# EAGLE schematic rapidshark_mark_5 (EAGLE 6.5.0)
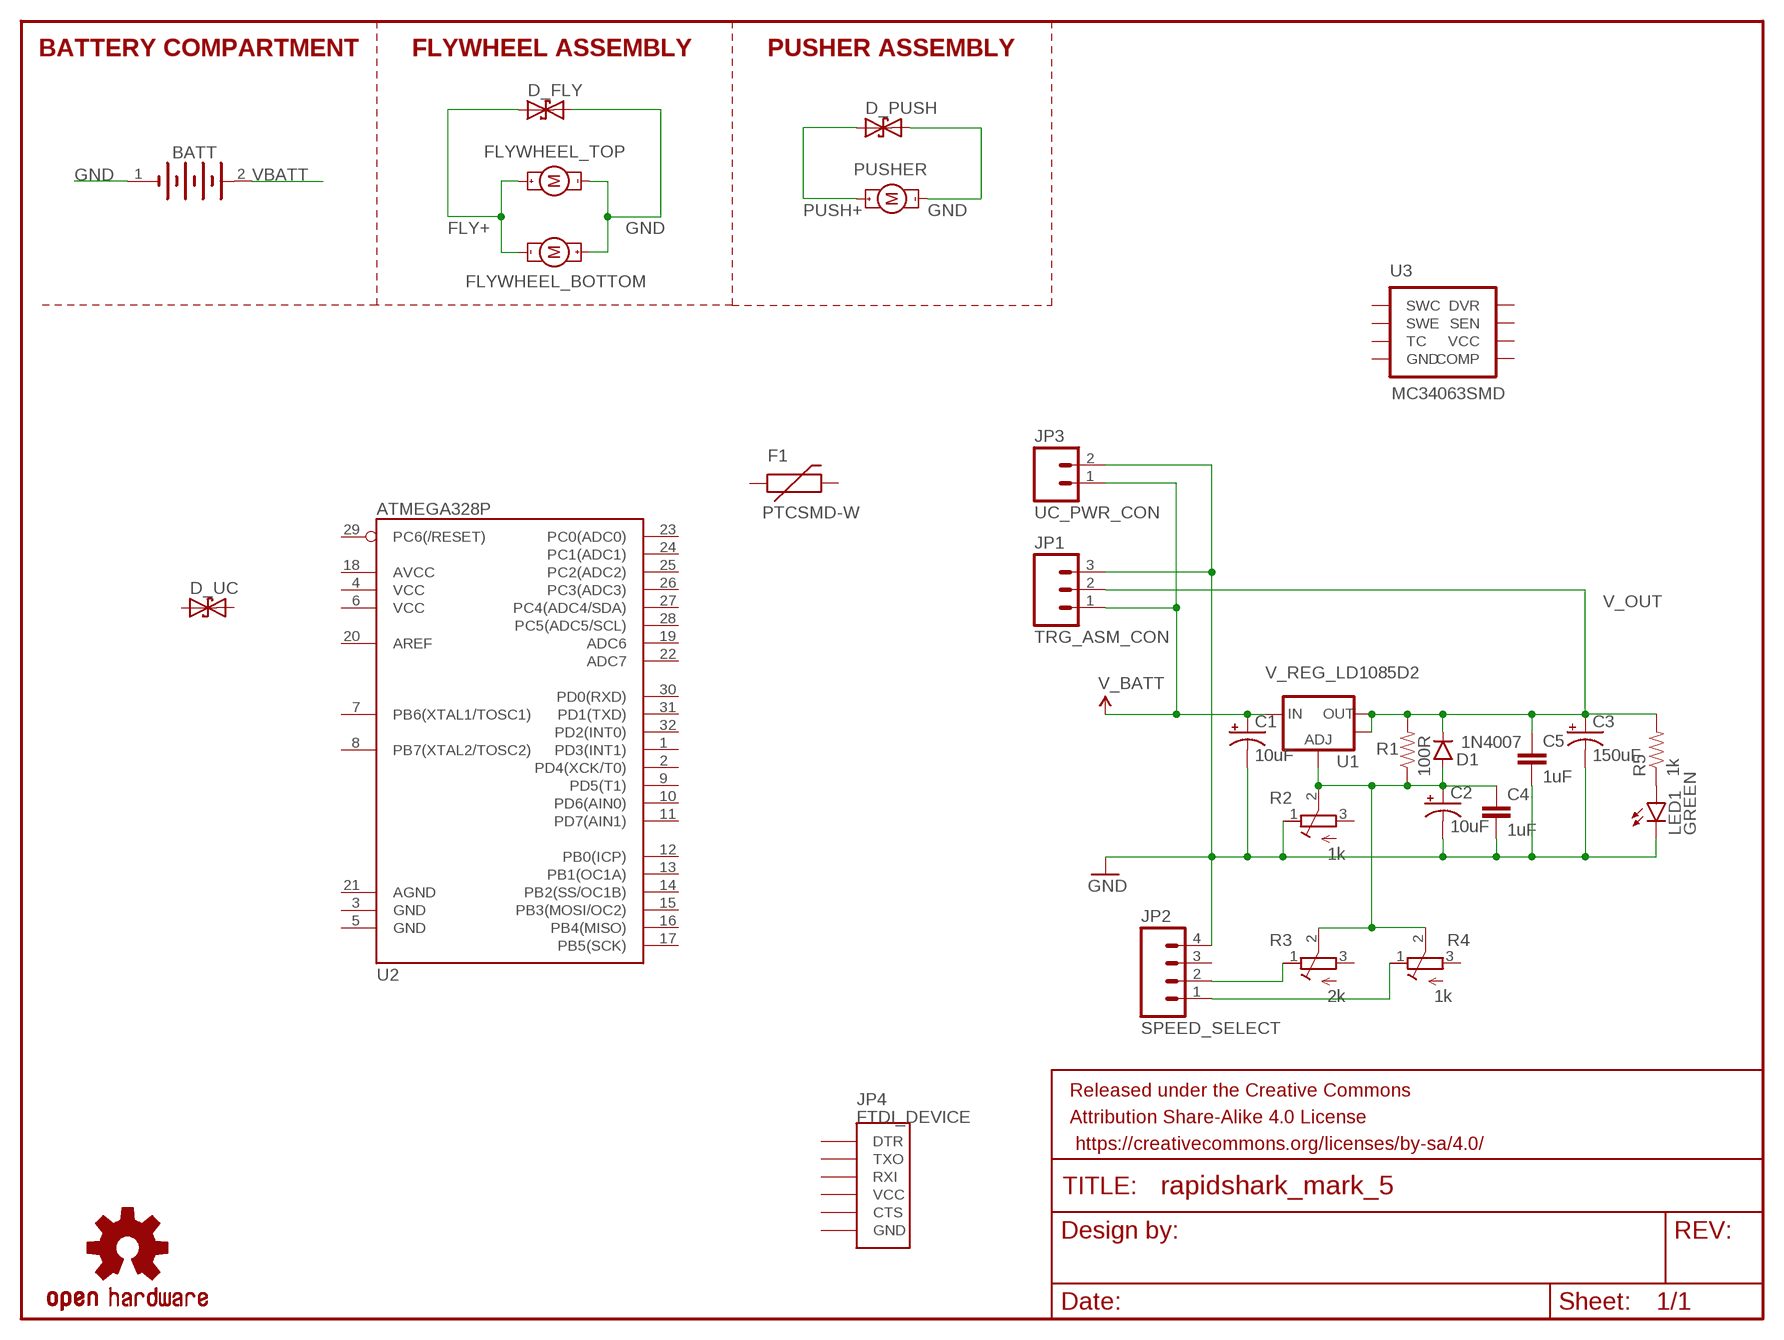
[diagram p0: schematic, sheet 1]

## Parts
BATT  LIPO4S_14.8V_EXT5MMSCREW  [1X02_5MM_SCREW]
C1  10uF  CPOL-USE2-5  [E2-5]
C2  10uF  CPOL-USE2-5  [E2-5]
C3  150uF  CPOL-USTT5D11L  [TT5D11L]
C4  1uF  CAPPTH  [CAP-PTH-SMALL]
C5  1uF  CAPPTH  [CAP-PTH-SMALL]
D1  1N4007  DIODEPTH  [DIODE-1N4001]
D_FLY  P6KEXXC  [CB417-15]
D_PUSH  P6KEXXC  [CB417-15]
D_UC  P6KEXXC  [CB417-15]
F1  PTCSMD-W  [PTC-1206-WIDE]
FLYWHEEL_BOTTOM  MOTOR  (no package)
FLYWHEEL_TOP  MOTOR  (no package)
FRAME1  FRAME-LETTER  [CREATIVE_COMMONS]
JP1  TRG_ASM_CON  M03-SCREW-5MM  [SCREWTERMINAL-5MM-3]
JP2  SPEED_SELECT  M04PTH  [1X04]
JP3  UC_PWR_CON  M02PTH  [1X02]
JP4  FTDI_DEVICE  [FTDI_DEVICE_SIDE]
LED1  GREEN  LED3MM  [LED3MM]
LOGO1  OSHW-LOGOS  [OSHW-LOGO-S]
PUSHER  MOTOR  (no package)
R1  100R  RESISTORAXIAL-0.3  [AXIAL-0.3]
R2  1k  R-TRIMMT93XA  [RTRIMT93XA]
R3  2k  R-TRIMMT93XA  [RTRIMT93XA]
R4  1k  R-TRIMMT93XA  [RTRIMT93XA]
R5  1k  RESISTORAXIAL-0.3  [AXIAL-0.3]
U1  V_REG_LD1085D2  [D2PACK/A]
U2  ATMEGA328P  ATMEGA328_SMT  [TQFP32-08]
U3  MC34063SMD  [SO08]

## Nets
ADJ: C2.+ C4.1 D1.A R1.P$1 R2.2(S) R3.2(S) R4.2(S) U1.1(ADJ)
FLY+: D_FLY.A FLYWHEEL_BOTTOM.- FLYWHEEL_TOP.+
GND: BATT.1(-) C1.- C2.- C3.- C4.2 C5.2 D_FLY.C D_PUSH.C FLYWHEEL_BOTTOM.+ FLYWHEEL_TOP.- JP1.3 JP2.4 JP3.2 LED1.K(C) PUSHER.- R2.1(A)
N$1: JP2.2 R3.1(A)
N$2: JP2.1 R4.1(A)
N$3: LED1.A R5.P$1
PUSH+: D_PUSH.A PUSHER.+
V_BATT: C1.+ JP1.1 JP3.1 U1.3(IN)
V_OUT: C3.+ C5.1 D1.C JP1.2 R1.P$2 R5.P$2 U1.2(OUT) U1.TAB(OUT)
VBATT: BATT.2(+)
Unconnected: D_UC.A D_UC.C F1.1 F1.2 JP2.3 JP4.P$1(DTR) JP4.P$2(TXO) JP4.P$3(RXI) JP4.P$4(VCC) JP4.P$5(CTS) JP4.P$6(GND) R2.3(E) R3.3(E) R4.3(E) U2.1(PD3(INT1)) U2.2(PD4(XCK/T0)) U2.3(GND) U2.4(VCC) U2.5(GND) U2.6(VCC) U2.7(PB6(XTAL1/TOSC1)) U2.8(PB7(XTAL2/TOSC2)) U2.9(PD5(T1)) U2.10(PD6(AIN0)) U2.11(PD7(AIN1)) U2.12(PB0(ICP)) U2.13(PB1(OC1A)) U2.14(PB2(SS/OC1B)) U2.15(PB3(MOSI/OC2)) U2.16(PB4(MISO)) U2.17(PB5(SCK)) U2.18(AVCC) U2.19(ADC6) U2.20(AREF) U2.21(AGND) U2.22(ADC7) U2.23(PC0(ADC0)) U2.24(PC1(ADC1)) U2.25(PC2(ADC2)) U2.26(PC3(ADC3)) U2.27(PC4(ADC4/SDA)) U2.28(PC5(ADC5/SCL)) U2.29(PC6(/RESET)) U2.30(PD0(RXD)) U2.31(PD1(TXD)) U2.32(PD2(INT0)) U3.1(SWC) U3.2(SWE) U3.3(TC) U3.4(GND) U3.5(COMP) U3.6(VCC) U3.7(SEN) U3.8(DVR)

## Notes on the sheet
- BATTERY COMPARTMENT | FLYWHEEL ASSEMBLY | PUSHER ASSEMBLY

## Library data of the parts
BATT = butts:LIPO4S_14.8V_EXT: NC ACCU Varta Mempac S 4V8
C1-C3 = rcl:CPOL-US: POLARIZED CAPACITOR, American symbol
C4 C5 = SparkFun-Capacitors:CAP: Capacitor Standard 0603 ceramic capacitor, and 0.1" leaded capacitor.
D1 = SparkFun-DiscreteSemi:DIODE: Diode These are standard reverse protection diodes and small signal diodes. SMA package can handle up to about 1A. SOD-323 can handle about 200mA. What the SOD-323 package when ordering, there are some mfgs out there that are 5-pin packages.
D_FLY D_PUSH D_UC = diode:P6KEXXC: DIODE transient-voltage suppressor
F1 = SparkFun-PowerIC:PTC: Resettable Fuse PTC Resettable Fuse. Spark Fun Electronics SKU : COM-08357
FLYWHEEL_BOTTOM FLYWHEEL_TOP PUSHER = butts:MOTOR: Brushed DC Motor Symbol for a motor combined with screw terminal output pads for hookup (since it's unlikely you're soldering the motor itself to a board :P).
FRAME1 = SparkFun-Aesthetics:FRAME-LETTER: Schematic Frame Standard 8.5x11 US Letter frame
JP1 = SparkFun-Connectors:M03: Header 3 Standard 3-pin 0.1" header. Use with straight break away headers (SKU : PRT-00116), right angle break away headers (PRT-00553), swiss pins (PRT-00743), machine pins (PRT-00117), and female headers (PRT-00115). Molex polarized connector foot print use with SKU : PRT-08232 with associated crimp pins and housings.
JP2 = SparkFun-Connectors:M04: Header 4 Standard 4-pin 0.1" header. Use with straight break away headers (SKU : PRT-00116), right angle break away headers (PRT-00553), swiss pins (PRT-00743), machine pins (PRT-00117), and female headers (PRT-00115). Molex polarized connector foot print use with SKU : PRT-08231 with associated crimp pins and housings. 1MM SMD Version SKU: PRT-10208
JP3 = SparkFun-Connectors:M02: Standard 2-pin 0.1" header. Use with - straight break away headers ( PRT-00116) - right angle break away headers (PRT-00553) - swiss pins (PRT-00743) - machine pins (PRT-00117) - female headers (PRT-00115) Molex polarized connector foot print use with: PRT-08233 with associated crimp pins and housings. 2.54_SCREWTERM for use with PRT-10571. 3.5mm Screw Terminal footprints for PRT-08084 5mm Screw Terminal footprints for use with PRT-08433
JP4 = SparkFun-Connectors:FTDI_DEVICE: Connector which mates to FTDI basic or FTDI cable.
LED1 = SparkFun-LED:LED: LEDs Standard schematic elements and footprints for 5mm, 3mm, 1206, and 0603 sized LEDs. 5mm - Spark Fun Electronics SKU : COM-00529 (and others)
LOGO1 = SparkFun-Aesthetics:OSHW-LOGO: Open Source Hardware Logo This logo indicates the piece of hardware it is found on incorporates a OSHW license and/or adheres to the definition of open source hardware found here: http://freedomdefined.org/OSHW
R1 R5 = SparkFun-Resistors:RESISTOR: Resistor Basic schematic elements and footprints for 0603, 1206, and PTH resistors.
R2-R4 = resistor:R-TRIMM: Trimm resistor
U1 = SparkFun-PowerIC:V_REG_LD1085: LD1085 3A low-drop positive voltage regulator, adjustable The LD1085xx is a low drop voltage regulator able to provide up to 3 A of output current. Dropout is guaranteed at a maximum of 1.2 V at the maximum output current, decreasing at lower loads. The LD1085xx is pin to pin compatible with the older 3-terminal adjustable regulators, but has better performances in term of drop and output tolerance. Available Packages D2PAK/A - 3-pin w/ tabs, SMD
U2 = SparkFun-DigitalIC:ATMEGA328_SMT: 32-Pin Atmega328 part Commonly used on Arduino compatible boards Available in QFP and QFN packages TQFP is IC-09069 QFN is non-stock; PROD_ID: IC-09069
U3 = SparkFun-PowerIC:MC34063: Jellybean switching supply controller